# Altium schematic sheet Sheet1.SchDoc
size 420 x 297 mm; Language: en; ResponsibleDept: DED; DocumentStatus: Released; DecimalNumber: {DecimalNumber}; ApprovedBy: Мельников; CheckedBy: Соколов; CompanyName: Диаконт; DrawnBy: Тихонов; DocumentNumber: ЭИТЦЯ.468332.338 Э3; SheetNumber: 1; SheetTotal: 3; Title0: Модуль управления РМ; DocumentType: Схема электрическая принципиальная; Liter: Э; PageSetup: Record=PageOptions|CenterHorizontal=True|CenterVertical=True|PrintScale=0.96|XCorrection=1.00|YCorrection=1.00|PrintKind=1|BorderSize=5000000|LeftOffset=0|BottomOffset=0|Orientation=2|PaperLength=1000|PaperWidth=1000|Scale=100|PaperSource=7|PrintQuality=-4|MediaType=1|DitherType=10|PaperKind=A3|PrintScaleMode=1; FirstApp: ИТЦЯ.468332.338
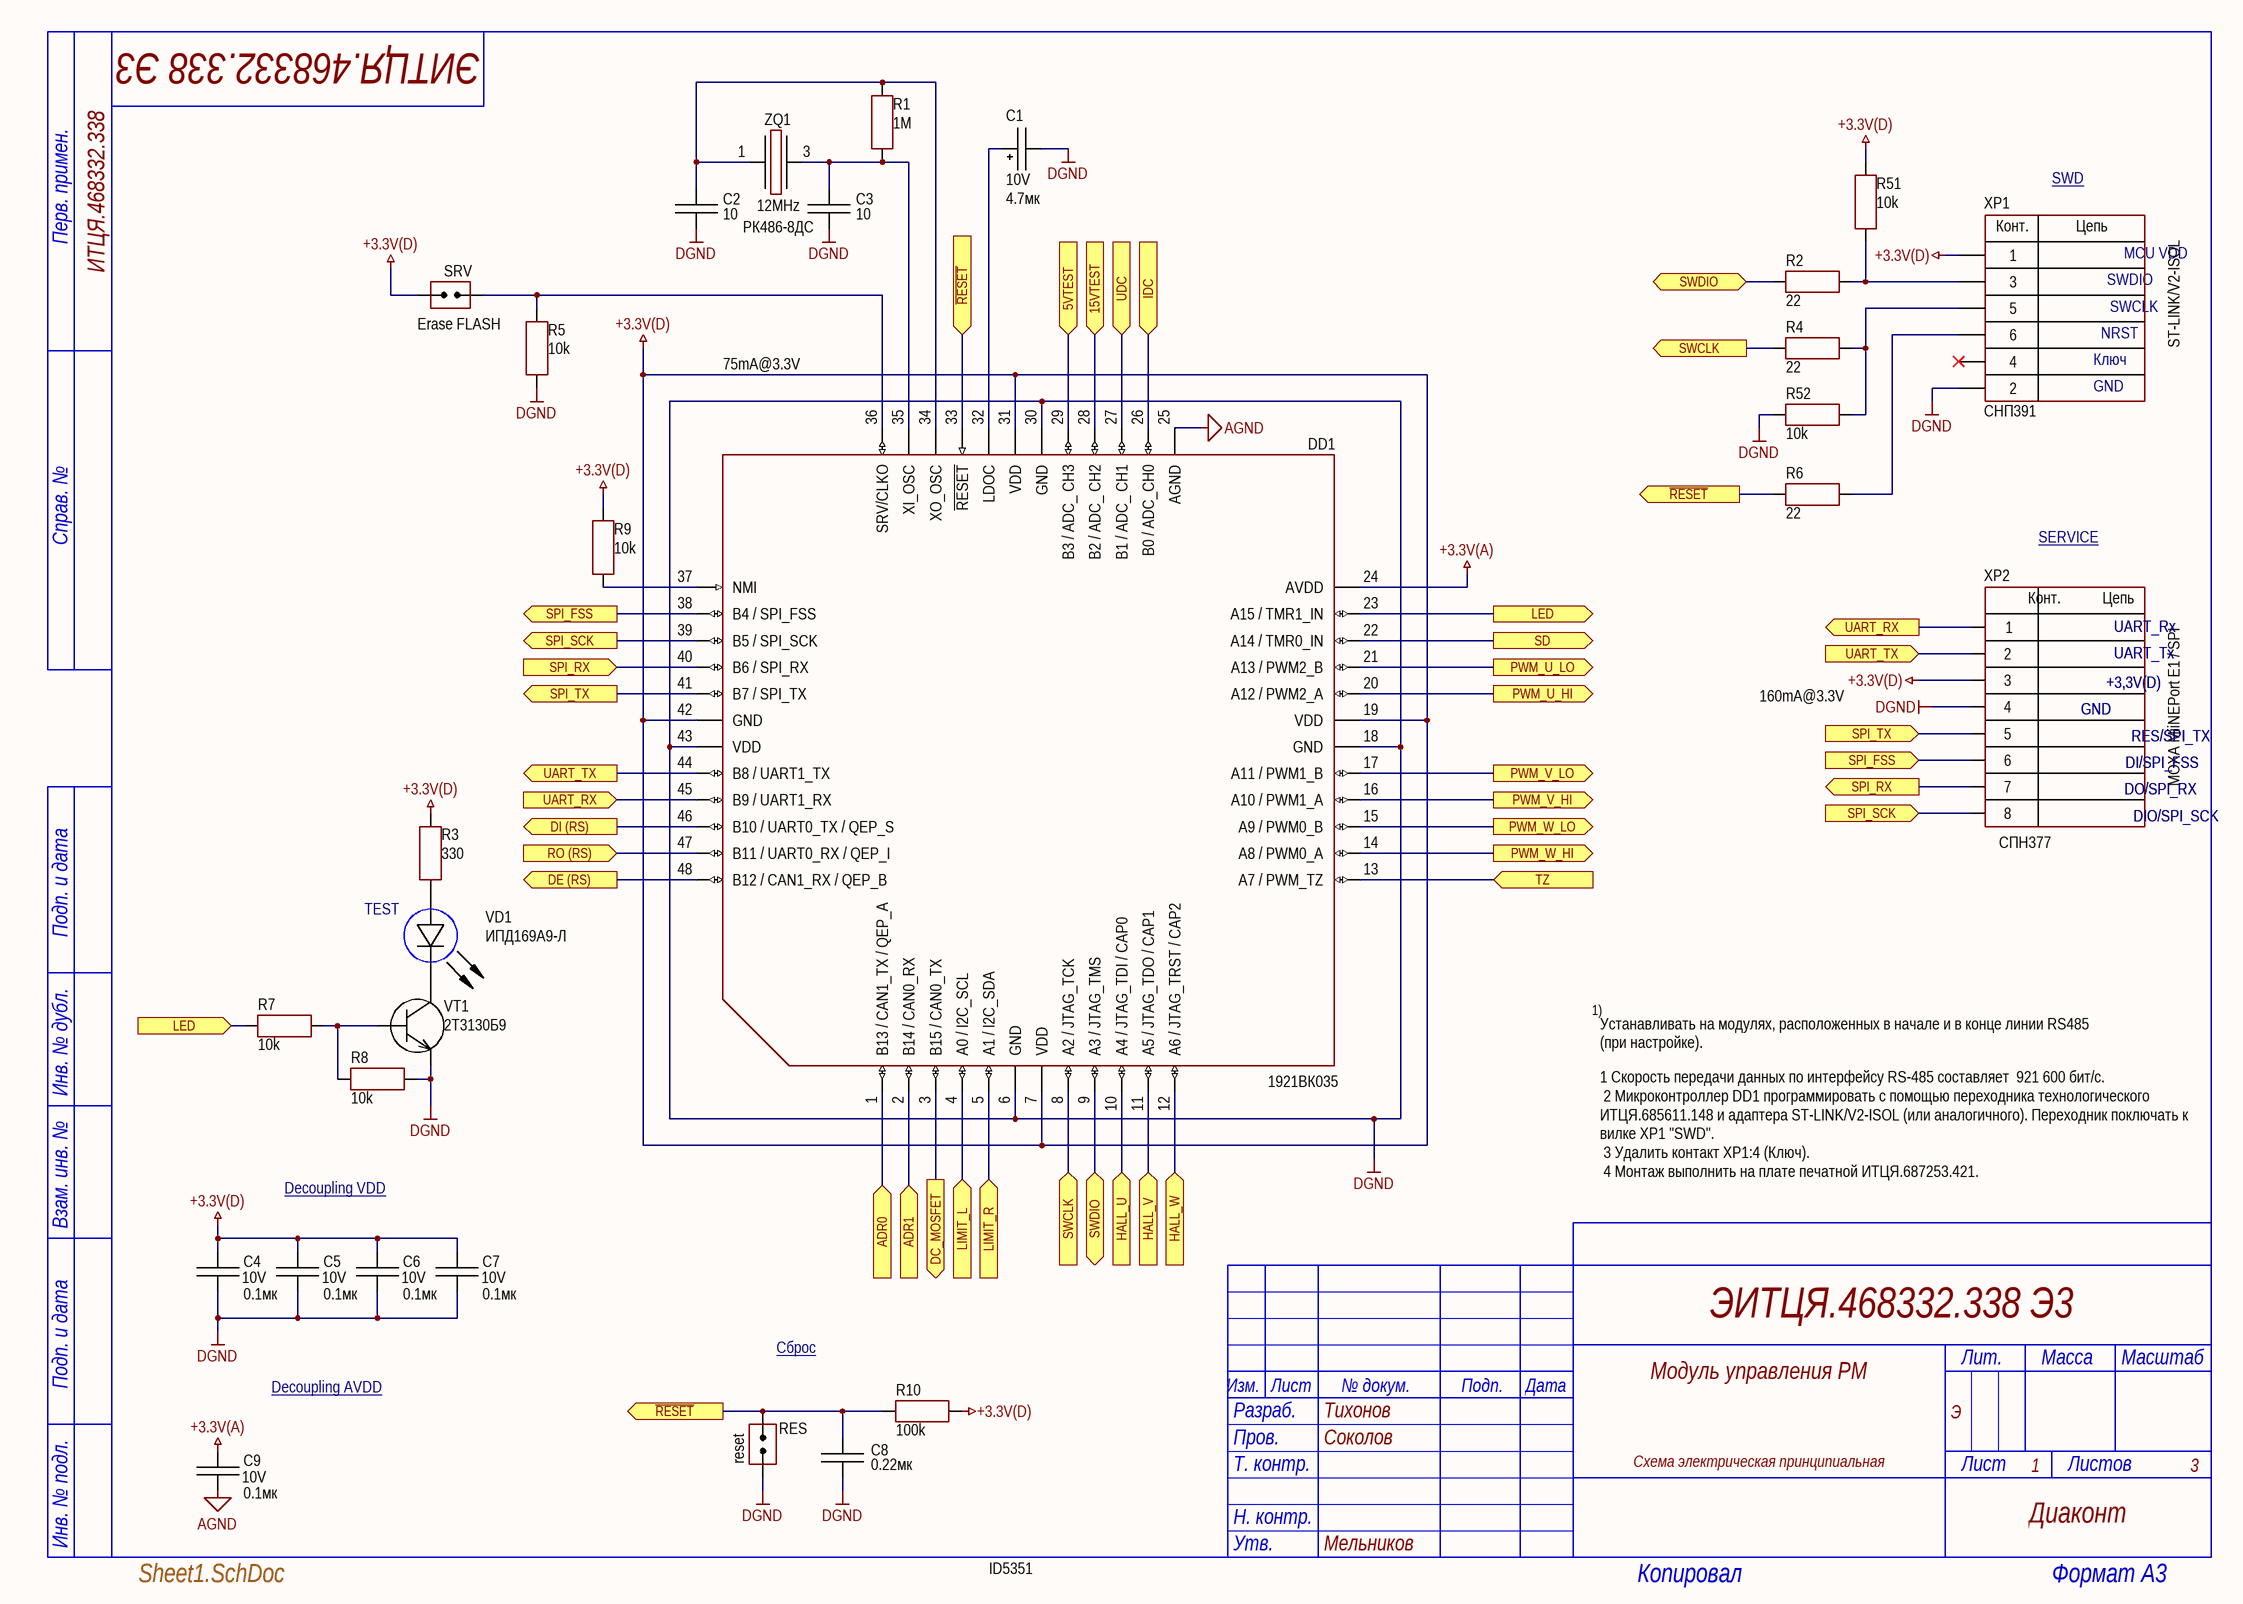
[diagram p0: Sheet1.SchDoc]

## Parts
C1  value 4.7мк  Voltage: 10V  [CAP: TANTAL-A]
C2  value 10  [CAP: 0603P]
C3  value 10  [CAP: 0603P]
C4  value 0.1мк  Voltage: 10V  [CAP: 0603P]
C5  value 0.1мк  Voltage: 10V  [CAP: 0603P]
C6  value 0.1мк  Voltage: 10V  [CAP: 0603P]
C7  value 0.1мк  Voltage: 10V  [CAP: 0603P]
C8  value 0.22мк  [CAP: 0805P]
C9  value 0.1мк  Voltage: 10V  [CAP: 0603P]
DD1  (no value)  [48-QLCC (МК 5162.48-1) - small pads]
R1  value 1М  [RES: 0603P]
R2  value 22  [RES: 0603P]
R3  value 330  [RES: 0603P]
R4  value 22  [RES: 0603P]
R5  value 10k  [RES: 0603P]
R6  value 22  [RES: 0603P]
R7  value 10k  [RES: 0603P]
R8  value 10k  [RES: 0603P]
R9  value 10k  [RES: 0603P]
R10  value 100k  [RES: 0603P]
R51  value 10k  [RES: 0603P]
R52  value 10k  [RES: 0603P]
RES  CommentText: reset  [CON: JUMPER x1]
SRV  CommentText: Erase FLASH  [CON: JUMPER x1]
VD1  PartNumber: ИПД169А9-Л  CommentText: TEST  [LED: 0603G]
VT1  PartNumber: 2Т3130Б9  [SOT23]
XP1  CommentText: СНП391  [CON: PLLD-6-S]  (hidden comment: SWD)
XP2  CommentText: СПН377  [CON: PLD2-8-S]  (hidden comment: SERVICE)
ZQ1  Frequency: 12MHz  CommentPart: РК486-8ДС  [OSC: 5070G]

## Ports
5VTEST (in), 15VTEST (in), ADR0 (in), ADR1 (in), DC_MOSFET (out), DE (RS) (out), DI (RS) (out), HALL_U (in), HALL_V (in), HALL_W (in), IDC (in), LED (in), LED (out), LIMIT_L (in), LIMIT_R (in), PWM_U_HI (out), PWM_U_LO (out), PWM_V_HI (out), PWM_V_LO (out), PWM_W_HI (out), PWM_W_LO (out), RO (RS) (in), SD (out), SPI_FSS (in), SPI_FSS (out), SPI_RX (in), SPI_RX (out), SPI_SCK (in), SPI_SCK (out), SPI_TX (in), SPI_TX (out), SWCLK (in), SWCLK (out), SWDIO (bidir), TZ (in), UART_RX (in), UART_RX (out), UART_TX (in), UART_TX (out), UDC (in), ~{RESET} (in), ~{RESET} (out)

## Nets
+3.3V(A): C9.2 DD1.24(AVDD)
+3.3V(D): C4.2 C5.2 C6.2 C7.2 DD1.7(VDD) DD1.19(VDD) DD1.31(VDD) DD1.42(GND) R3.1 R9.1 R10.2 R51.1 SRV.1(IN) XP1.1 XP2.3
AGND: C9.1 DD1.25(AGND)
DGND: C1.2 C2.2 C3.2 C4.1 C5.1 C6.1 C7.1 C8.1 DD1.6(GND) DD1.18(GND) DD1.30(GND) DD1.43(VDD) R5.2 R8.1 R52.1 RES.1(IN) VT1.2(E) XP1.2 XP2.4
5VTEST: DD1.29(B3_/_ADC__CH3) ; port 5VTEST
15VTEST: DD1.28(B2_/_ADC__CH2) ; port 15VTEST
~{RESET}: C8.2 DD1.33(~{RESET}) R6.1 R10.1 RES.2(IN) ; port ~{RESET}
ADR0: DD1.1(B13_/_CAN1_TX_/_QEP_A) ; port ADR0
ADR1: DD1.2(B14_/_CAN0_RX) ; port ADR1
DC_MOSFET: DD1.3(B15_/_CAN0_TX) ; port DC_MOSFET
DE (RS): DD1.48(B12_/_CAN1_RX_/_QEP_B) ; port DE (RS)
DI (RS): DD1.46(B10_/_UART0_TX_/_QEP_S) ; port DI (RS)
HALL_U: DD1.10(A4_/_JTAG_TDI_/_CAP0) ; port HALL_U
HALL_V: DD1.11(A5_/_JTAG_TDO_/_CAP1) ; port HALL_V
HALL_W: DD1.12(A6_/_JTAG_TRST_/_CAP2) ; port HALL_W
IDC: DD1.26(B0_/_ADC_CH0) ; port IDC
LED: DD1.23(A15_/_TMR1_IN) R7.2 ; port LED
LIMIT_L: DD1.4(A0_/_I2C_SCL) ; port LIMIT_L
LIMIT_R: DD1.5(A1_/_I2C_SDA) ; port LIMIT_R
PWM_U_HI: DD1.20(A12_/_PWM2_A) ; port PWM_U_HI
PWM_U_LO: DD1.21(A13_/_PWM2_B) ; port PWM_U_LO
PWM_V_HI: DD1.16(A10_/_PWM1_A) ; port PWM_V_HI
PWM_V_LO: DD1.17(A11_/_PWM1_B) ; port PWM_V_LO
PWM_W_HI: DD1.14(A8_/_PWM0_A) ; port PWM_W_HI
PWM_W_LO: DD1.15(A9_/_PWM0_B) ; port PWM_W_LO
RO (RS): DD1.47(B11_/_UART0_RX_/_QEP_I) ; port RO (RS)
SD: DD1.22(A14_/_TMR0_IN) ; port SD
SPI_FSS: DD1.38(B4_/_SPI_FSS) XP2.6 ; port SPI_FSS
SPI_RX: DD1.40(B6_/_SPI_RX) XP2.7 ; port SPI_RX
SPI_SCK: DD1.39(B5_/_SPI_SCK) XP2.8 ; port SPI_SCK
SPI_TX: DD1.41(B7_/_SPI_TX) XP2.5 ; port SPI_TX
SWCLK: DD1.8(A2_/_JTAG_TCK) R4.1 ; port SWCLK
SWDIO: DD1.9(A3_/_JTAG_TMS) R2.1 ; port SWDIO
TZ: DD1.13(A7_/_PWM_TZ) ; port TZ
UART_RX: DD1.45(B9_/_UART1_RX) XP2.1 ; port UART_RX
UART_TX: DD1.44(B8_/_UART1_TX) XP2.2 ; port UART_TX
UDC: DD1.27(B1_/_ADC__CH1) ; port UDC
NetC1_1: C1.1 DD1.32(LDOC)
NetC2_1: C2.1 DD1.34(XO_OSC) R1.2 ZQ1.1
NetC3_1: C3.1 DD1.35(XI_OSC) R1.1 ZQ1.3
NetDD1_36: DD1.36(SRV/CLKO) R5.1 SRV.2(IN)
NetDD1_37: DD1.37(NMI) R9.2
NetR2_2: R2.2 R51.2 XP1.3
NetR3_2: R3.2 VD1.1(A)
NetR4_2: R4.2 R52.2 XP1.5
NetR6_2: R6.2 XP1.6
NetR7_1: R7.1 R8.2 VT1.1(B)
NetVD1_2: VD1.2(C) VT1.3(C)

Not connected (* = marked no-connect by the designer): XP1 4*

## Notes on the sheet
- SWD
- MCU VDD
- SWDIO
- SWCLK
- 75mA@3.3V
- Ключ
- GND
- NRST
- ST-LINK/V2-ISOL
- SERVICE
- UART_Rx
- UART_Tx
- 160mA@3.3V
- (near XP2) +3,3V(D)
- DO/SPI_RX
- DI/SPI_FSS
- RES/SPI_TX
- MOXA MiiNEPort E1 / SPI
- DIO/SPI_SCK
- 1)
- Устанавливать на модулях, расположенных в начале и в конце линии RS485 (при настройке).
- Decoupling VDD
- 1 Скорость передачи данных по интерфейсу RS-485 составляет  921 600 бит/с.
  2 Микроконтроллер DD1 программировать с помощью переходника технологического ИТЦЯ.685611.148 и адаптера ST-LINK/V2-ISOL (или аналогичного). Переходник поключать к вилке XP1 "SWD".
  3 Удалить контакт XP1:4 (Ключ).
  4 Монтаж выполнить на плате печатной ИТЦЯ.687253.421.
- Decoupling AVDD
- Сброс
- ID5351
- Перв. примен.
- Справ. №
- Подп. и дата
- Инв. № дубл.
- Взам. инв. №
- Изм.
- Лист
- № докум.
- Подп.
- Дата
- Лит.
- Масса
- Масштаб
- Разраб.
- Пров.
- Т. контр.
- Листов
- Инв. № подл.
- Н. контр.
- Утв.
- Копировал
- Формат A3
- (in symbol PLD2-8-S) Конт.; Цепь
- (in symbol PLLD1.27-6_1) Конт.; Цепь

## Library data of the parts
C1 = Tantal_A: Manufacturer: Элеконд; PartNumber: К53-68 "А"-10 В-4.7 мкф; ValueManufacturerPartNumber: Tantalum capacitor, 4.7мк, 10V, ±10%, 2Ohm, case A (3216), -55...+125°C; Impedance: 2Ohm; Tolerance: ±10%; TypeDielectric: X7R; TypeCapacitor: Tantalum capacitor; MAX: 00130629; Package: case A (3216); HelpURL: https://www.digikey.com/product-detail/en/avx-corporation/F930J107KAAAJ6/478-12404-1-ND/9645231; Temperature: -55...+125°C
C2 C3 = Ceramic_0603: Manufacturer: Монолит; PartNumber: К10-84в-1608М-50В-10 пФ ±5%-МП0-N-A; ValueManufacturerPartNumber: Ceramic capacitor, 10, МП0, ±5%, 50V, 0603, -55...+125°C; TypeCapacitor: Ceramic capacitor; Tolerance: ±5%; TypeDielectric: МП0; Voltage: 50V; Analog: 00133079 (pin-to-pin); Package: 0603; Temperature: -55...+125°C
C4-C7 C9 = Ceramic_0603: Manufacturer: Гириконд; PartNumber: К10-79-10В-0,1 мкФ +80-20% H90; ValueManufacturerPartNumber: Ceramic capacitor, 0.1мк, H90, +80-20%, 10V, 0603, -55...+125°C; TypeCapacitor: Ceramic capacitor; Tolerance: +80-20%; TypeDielectric: H90; MAX: 00131675; Package: 0603; HelpURL: http://www.giricond.ru/files/k10-79_vp_2018_saiyt.pdf; Temperature: -55...+125°C
C8 = Ceramic_5750M: Manufacturer: Монолит; PartNumber: К10-84в-1608М-25В-220 нФ +80/-20%-Н90-N-A; ValueManufacturerPartNumber: Ceramic capacitor, 0.22мк, H90, +80/-20%, 25V, 0805 (2012M), -55...+125°C; TypeCapacitor: Ceramic capacitor; Tolerance: +80/-20%; TypeDielectric: H90; Voltage: 25V; Analog: MAX 00131682 (pin-to-pin); Package: 0805 (2012M); Temperature: -55...+125°C
DD1 = 1921ВК035: Cortex-M4F; Manufacturer: НИИЭТ; ValueManufacturerPartNumber: Motor control microcontroller, 32-Bit, RISC, 100MHz, 64KB, 16KB, 3,3 В ± 10 %., -60...+85°C, 48-QLCC (МК 5162.48-1); Supply: 3,3 В ± 10 %.; Speed: 100MHz; CoreSize: 32-Bit; MemoryROM: 64KB; MemoryRAM: 16KB; CoreProcessor: RISC; HelpURL: https://niiet.ru/goods/tranzmod/newtr; Package: 48-QLCC (МК 5162.48-1); ComponentType: Motor control microcontroller; Temperature: -60...+85°C; PartNumber: 1921ВК035
R1 = Resistor_0603: Manufacturer: ОАО Ресурс; PartNumber: Р1-12-0,1ум.-1~МОм ±5%-М ШКАБ.434110.002 ТУ; ValueManufacturerPartNumber: Resistor film, 1М, ±5%, 0603, 0.1W, -55...+125°C; TypeResistor: Resistor film; Power: 0.1W; Tolerance: ±5%; MAX: 00133970; Package: 0603; HelpURL: https://aoresurs.com/catalog/chip_rezistory/rezistory-r1-12-kategoriya-kachestva-vp-/; Temperature: -55...+125°C
R2 R4 R6 = Resistor_0603: Manufacturer: ОАО Ресурс; PartNumber: Р1-12-0,1ум.-22~Ом ±5%-М ШКАБ.434110.002 ТУ; ValueManufacturerPartNumber: Resistor film, 22, ±5%, 0603, 0.1W, -55...+125°C; TypeResistor: Resistor film; Power: 0.1W; Tolerance: ±5%; MAX: 00134024; Package: 0603; HelpURL: https://aoresurs.com/catalog/chip_rezistory/rezistory-r1-12-kategoriya-kachestva-vp-/; Temperature: -55...+125°C
R3 = Resistor_0603: Manufacturer: ОАО Ресурс; PartNumber: Р1-12-0,1ум.-330~Ом ±5%-М ШКАБ.434110.002 ТУ; ValueManufacturerPartNumber: Resistor film, 330, ±5%, 0603, 0.1W, -55...+125°C; TypeResistor: Resistor film; Power: 0.1W; Tolerance: ±5%; MAX: 00134047; Package: 0603; HelpURL: https://aoresurs.com/catalog/chip_rezistory/rezistory-r1-12-kategoriya-kachestva-vp-/; Temperature: -55...+125°C
R5 R7-R9 R51 R52 = Resistor_0603: Manufacturer: ОАО Ресурс; PartNumber: Р1-12-0,1ум.-10~кОм ±5%-М ШКАБ.434110.002 ТУ; ValueManufacturerPartNumber: Resistor film, 10k, ±5%, 0603, 0.1W, -55...+125°C; TypeResistor: Resistor film; Power: 0.1W; Tolerance: ±5%; MAX: 00133985; Analog: MAX 00133985; Package: 0603; HelpURL: https://aoresurs.com/catalog/chip_rezistory/rezistory-r1-12-kategoriya-kachestva-vp-/; Temperature: -55...+125°C
R10 = Resistor_0603: Manufacturer: ОАО Ресурс; PartNumber: Р1-12-0,1ум.-100~кОм ±5%-М ШКАБ.434110.002 ТУ; ValueManufacturerPartNumber: Resistor film, 100k, ±5%, 0603, 0.1W, -55...+125°C; TypeResistor: Resistor film; Power: 0.1W; Tolerance: ±5%; MAX: 00133990; Analog: MAX 00122851; Package: 0603; HelpURL: https://aoresurs.com/catalog/chip_rezistory/rezistory-r1-12-kategoriya-kachestva-vp-/; Temperature: -55...+125°C
RES = Jumper_single: PartNumber: СНП377-2ВП21-1-02-04; Manufacturer: ОАО "Карачевский завод "Электродеталь"; MAX: 00124338; Pitch: 2mm; Analog: MAX 00148900 (PLS2-2); HelpURL: http://www.elektrodetal.com/product/soediniteli-dlya-pechatnyh-plat/snp377.html; Type: штыри 2 пина в отв.
SRV = Jumper_single: PartNumber: СНП391-2ВП21-1 РЮМК.430420.036 ТУ; Manufacturer: ОАО "Карачевский завод "Электродеталь"; Pitch: 1.27mm; Analog: PLL1.27 (MAX 00150250 с доработкой до 2 пинов); HelpURL: http://www.elektrodetal.com/product/soediniteli-dlya-pechatnyh-plat/snp377.html; Type: штыри 2 пина в отв.
VD1 = LED_single: Manufacturer: Протон; ValueManufacturerPartNumber: LED, 20mA max, 2.1V typ, 1608, -55...+150°C; TypeDiode: LED; Current: 20mA max; VoltageDrop: 2.1V typ; Color: GREEN; Analog: MAX 00129484 КР-1608 Kingbright (pin-to-pin); Package: 1608; HelpURL: *; Temperature: -55...+150°C
VT1 = BJT_NPN_132: Manufacturer: ООО НПК Далекс; ValueManufacturerPartNumber: NPN transistor, 30V, 100mA, , 300mW, 0.7V, 500, SOT-23 (КТ-46), -55...+125°C; TypeTransistor: NPN transistor; VoltageCE: 30V; CurrentCE: 100mA; VoltageSaturation: 0.7V; CurrentGain: 500; MaxPower: 300mW; MAX: 00123842; Package: SOT-23 (КТ-46); HelpURL: http://www.radioman-portal.ru/sprav/pp/transisters/sourse/2t3130.pdf; Temperature: -55...+125°C
XP1 = PLLD1.27-6_1: аналог СНП391-6ВП41-2; Manufacturer: Электроделать; ValueManufacturerPartNumber: Connector, 6pin, 1.27mm, 125VAC, 1A; PartNumber: СНП391-6ВП41-2 РЮМК.430420.036 ТУ; TypeConnector: Connector; VoltageMax: 125VAC; Pitch: 1.27mm; CurrentMax: 1A; Multichannel: 6pin; Analog: MAX 00130684 c доработкой до 6 пинов; HelpURL: https://www.elektrodetal.com/catalog/snp391/; Analog 1: PLLD1.27-6
XP2 = PLD2-8-S: СНП377-8ВП41-2 SMD; Manufacturer: ОАО "Карачевский завод "Электродеталь"; TU: РЮМК.430420.017 ТУ; Pitch: 2mm; Value: *; RefDes/Designator: *; Pattern/Footprint: *; Type: Вилка; HelpURL: https://www.elektrodetal.com/catalog/snp377/; Analog: PLD2-8-S; PartNumber: СНП377-8ВП41-2
ZQ1 = Oscilator_5070: Manufacturer: ОАО "Морион"; PartNumber: РК486-8ДС-12000K; ValueManufacturerPartNumber: Oscilator, 12MHz, CMOS, ±30ppm, case 5070, -40...+85°C; LoadCapacitance: CMOS; Tolerance: ±30ppm; MAX: 00149842; Package: case 5070; HelpURL: http://www.lit-phonon.ru/downloads/RK486.pdf; Temperature: -40...+85°C; TypeOscilator: Oscilator